# EAGLE schematic 13thISE.ver9 (EAGLE 9.6.2)
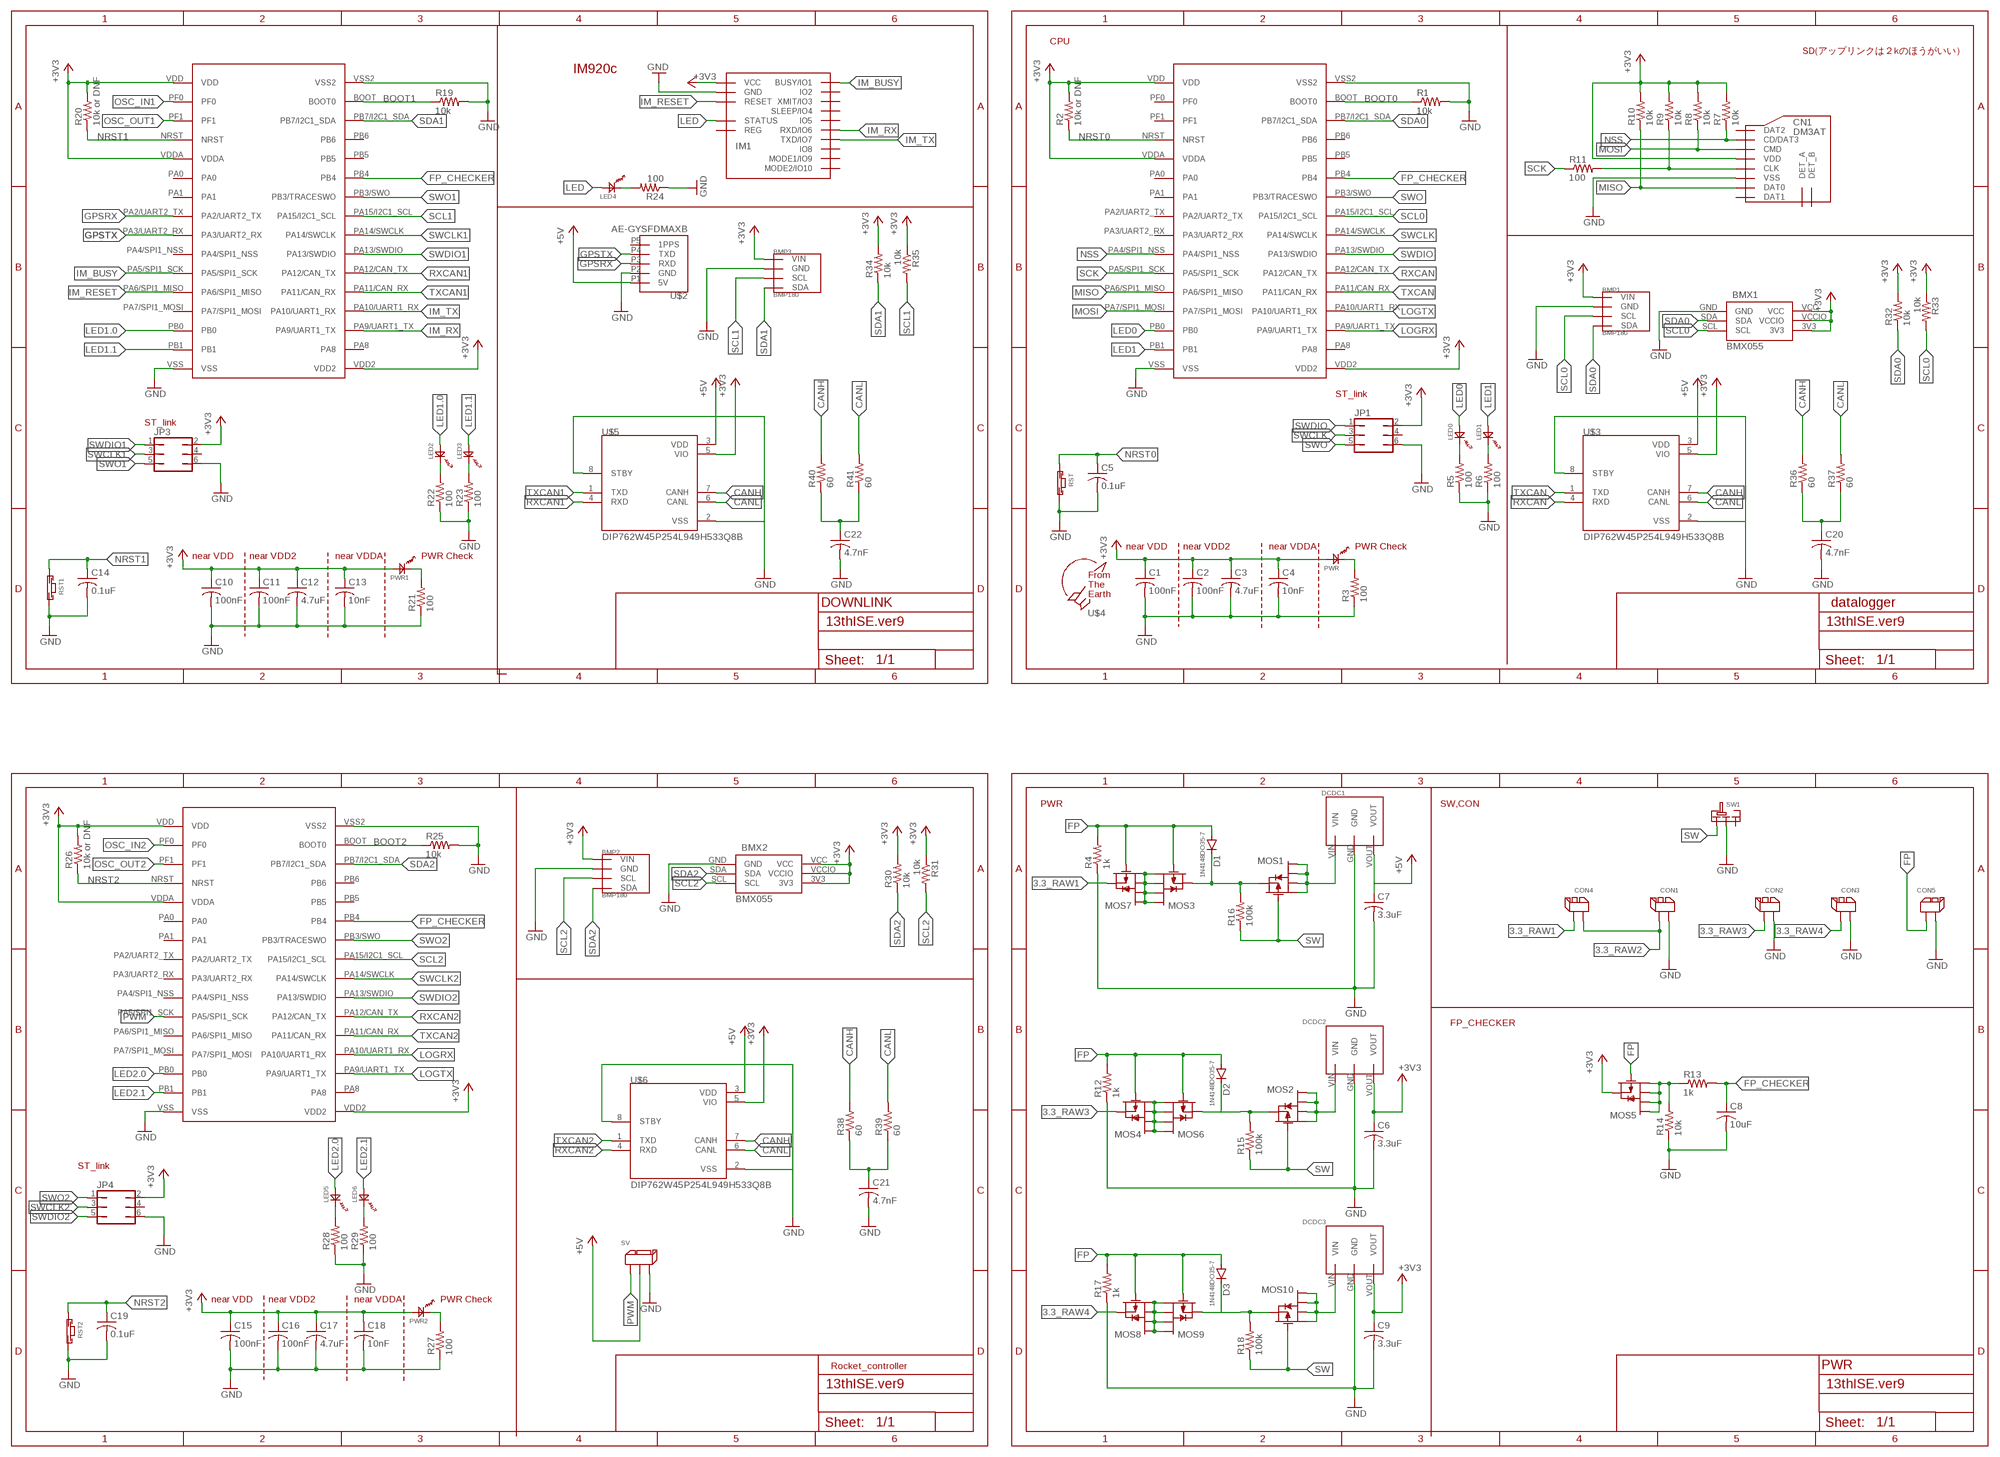
[diagram p0: schematic, sheet 1]

## Parts
BMP1  BMP180  [GY-68]
BMP2  BMP180  [GY-68]
BMP3  BMP180  [GY-68]
BMX1  BMX055  [BMX055]
BMX2  BMX055  [BMX055]
C1  100nF  C-USC1608  [C1608]
C2  100nF  C-USC1608  [C1608]
C3  4.7uF  C-USC1608  [C1608]
C4  10nF  C-USC1608  [C1608]
C5  0.1uF  C-USC1608  [C1608]
C6  3.3uF  C-USC0603  [C0603]
C7  3.3uF  C-USC0603  [C0603]
C8  10uF  C-USC0603  [C0603]
C9  3.3uF  C-USC0603  [C0603]
C10  100nF  C-USC1608  [C1608]
C11  100nF  C-USC1608  [C1608]
C12  4.7uF  C-USC1608  [C1608]
C13  10nF  C-USC1608  [C1608]
C14  0.1uF  C-USC1608  [C1608]
C15  100nF  C-USC1608  [C1608]
C16  100nF  C-USC1608  [C1608]
C17  4.7uF  C-USC1608  [C1608]
C18  10nF  C-USC1608  [C1608]
C19  0.1uF  C-USC1608  [C1608]
C20  4.7nF  C-USC0603  [C0603]
C21  4.7nF  C-USC0603  [C0603]
C22  4.7nF  C-USC0603  [C0603]
CN1  DM3AT  [DM3AT]
CON1  2PIN  [2PIN]
CON2  2PIN  [2PIN]
CON3  2PIN  [2PIN]
CON4  2PIN  [2PIN]
CON5  2PIN  [2PIN]
D1  1N4148DO35-7  [DO35-7]
D2  1N4148DO35-7  [DO35-7]
D3  1N4148DO35-7  [DO35-7]
DCDC1  5V1A_M78AR05-1  [5V1A_M78AR05-1]
DCDC2  3.3V1A_M78AR033-1  [3.3V1A_M78AR033-1]
DCDC3  3.3V1A_M78AR033-1  [3.3V1A_M78AR033-1]
IM1  IM920_IM920C  [IM920_IM920C]
JP1  JP3Q  [JP3Q]
JP3  JP3Q  [JP3Q]
JP4  JP3Q  [JP3Q]
LED0  OSXX1608C1A  [OSXX1608C1A]
LED1  OSXX1608C1A  [OSXX1608C1A]
LED2  OSXX1608C1A  [OSXX1608C1A]
LED3  OSXX1608C1A  [OSXX1608C1A]
LED4  OSXX1608C1A  [OSXX1608C1A]
LED5  OSXX1608C1A  [OSXX1608C1A]
LED6  OSXX1608C1A  [OSXX1608C1A]
MOS1  PCH_SSM6J808R  [SSM6J808R]
MOS2  PCH_SSM6J808R  [SSM6J808R]
MOS3  PCH_SSM6J808R  [SSM6J808R]
MOS4  PCH_SSM6J808R  [SSM6J808R]
MOS5  PCH_SSM6J808R  [SSM6J808R]
MOS6  PCH_SSM6J808R  [SSM6J808R]
MOS7  PCH_SSM6J808R  [SSM6J808R]
MOS8  PCH_SSM6J808R  [SSM6J808R]
MOS9  PCH_SSM6J808R  [SSM6J808R]
MOS10  PCH_SSM6J808R  [SSM6J808R]
PWR  OSXX1608C1A  [OSXX1608C1A]
PWR1  OSXX1608C1A  [OSXX1608C1A]
PWR2  OSXX1608C1A  [OSXX1608C1A]
R1  10k  R-US_R0603  [R0603]
R2  10k or DNF  R-US_R0603  [R0603]
R3  100  R-US_R0603  [R0603]
R4  1k  R-US_R0603  [R0603]
R5  100  R-US_R0603  [R0603]
R6  100  R-US_R0603  [R0603]
R7  10k  R-US_R0603  [R0603]
R8  10k  R-US_R0603  [R0603]
R9  10k  R-US_R0603  [R0603]
R10  10k  R-US_R0603  [R0603]
R11  100  R-US_R0603  [R0603]
R12  1k  R-US_R0603  [R0603]
R13  1k  R-US_R0603  [R0603]
R14  10k  R-US_R0603  [R0603]
R15  100k  R-US_R0603  [R0603]
R16  100k  R-US_R0603  [R0603]
R17  1k  R-US_R0603  [R0603]
R18  100k  R-US_R0603  [R0603]
R19  10k  R-US_R0603  [R0603]
R20  10k or DNF  R-US_R0603  [R0603]
R21  100  R-US_R0603  [R0603]
R22  100  R-US_R0603  [R0603]
R23  100  R-US_R0603  [R0603]
R24  100  R-US_R0603  [R0603]
R25  10k  R-US_R0603  [R0603]
R26  10k or DNF  R-US_R0603  [R0603]
R27  100  R-US_R0603  [R0603]
R28  100  R-US_R0603  [R0603]
R29  100  R-US_R0603  [R0603]
R30  10k  R-US_R0603  [R0603]
R31  10k  R-US_R0603  [R0603]
R32  10k  R-US_R0603  [R0603]
R33  10k  R-US_R0603  [R0603]
R34  10k  R-US_R0603  [R0603]
R35  10k  R-US_R0603  [R0603]
R36  60  R-US_R0603  [R0603]
R37  60  R-US_R0603  [R0603]
R38  60  R-US_R0603  [R0603]
R39  60  R-US_R0603  [R0603]
R40  60  R-US_R0603  [R0603]
R41  60  R-US_R0603  [R0603]
RST  TVAF06-A020B-R  [TVAF06-A020B-R]
RST1  TVAF06-A020B-R  [TVAF06-A020B-R]
RST2  TVAF06-A020B-R  [TVAF06-A020B-R]
STM0  STM32F303K8  [STM32F303K8]
STM1  STM32F303K8  [STM32F303K8]
SV  3PIN  [3PIN]
SW1  SRIDE_SWITCH  [SRIDE_SWITCH]
U$1  STM32F303K8  [STM32F303K8]
U$2  AE-GYSFDMAXB  [AE-GYSFDMAXB]
U$3  DIP762W45P254L949H533Q8B  [DIP762W45P254L949H533Q8B]
U$4  F.T.E.LOGO  [LOGO]
U$5  DIP762W45P254L949H533Q8B  [DIP762W45P254L949H533Q8B]
U$6  DIP762W45P254L949H533Q8B  [DIP762W45P254L949H533Q8B]

## Nets
3.3_RAW1: CON4.P$2 MOS7.4
3.3_RAW2: CON1.P$2 CON4.P$1
3.3_RAW3: CON2.P$2 MOS4.4
3.3_RAW4: CON3.P$2 MOS8.4
+3V3: BMP1.P1(VIN) BMP2.P1(VIN) BMP3.P1(VIN) BMX1.3V3 BMX1.VCC BMX1.VCCIO BMX2.3V3 BMX2.VCC BMX2.VCCIO C1.1 C2.1 C3.1 C4.1 C6.1 C9.1 C10.1 C11.1 C12.1 C13.1 C15.1 C16.1 C17.1 C18.1 CN1.VDD DCDC2.VOUT DCDC3.VOUT IM1.$P17(VCC) JP1.2 JP3.2 JP4.2 MOS5.4 PWR1.AN PWR2.AN PWR.AN R2.2 R7.2 R8.2 R9.2 R10.2 R20.2 R26.2 R30.2 R31.1 R32.2 R33.1 R34.2 R35.1 STM0.VDD STM0.VDD2 STM0.VDDA STM1.VDD STM1.VDD2 STM1.VDDA U$1.VDD U$1.VDD2 U$1.VDDA U$3.5(VIO) U$5.5(VIO) U$6.5(VIO)
+5V: C7.1 DCDC1.VOUT SV.P$2 U$2.P1(5V) U$3.3(VDD) U$5.3(VDD) U$6.3(VDD)
+5V1: DCDC1.VIN MOS1.1 MOS1.2 MOS1.5 MOS1.6
BOOT0: R1.1 STM0.BOOT(BOOT0)
BOOT1: R19.1 STM1.BOOT(BOOT0)
BOOT2: R25.1 U$1.BOOT(BOOT0)
CANH: R36.2 R38.2 R40.2 U$3.7(CANH) U$5.7(CANH) U$6.7(CANH)
CANL: R37.2 R39.2 R41.2 U$3.6(CANL) U$5.6(CANL) U$6.6(CANL)
FP: CON5.P$1 D1.A D2.A D3.A MOS3.3 MOS4.3 MOS5.3 MOS6.3 MOS7.3 MOS8.3 MOS9.3 R4.2 R12.2 R17.2
FP_CHECKER: C8.1 R13.2 STM0.PB4 STM1.PB4 U$1.PB4
GND: BMP1.P2(GND) BMP2.P2(GND) BMP3.P2(GND) BMX1.GND BMX2.GND C1.2 C2.2 C3.2 C4.2 C5.2 C6.2 C7.2 C8.2 C9.2 C10.2 C11.2 C12.2 C13.2 C14.2 C15.2 C16.2 C17.2 C18.2 C19.2 C20.2 C21.2 C22.2 CN1.VSS CON1.P$1 CON2.P$1 CON3.P$1 CON5.P$2 DCDC1.GND DCDC2.GND DCDC3.GND IM1.$P18(GND) JP1.6 JP3.6 JP4.6 R1.2 R3.1 R4.1 R5.1 R6.1 R12.1 R14.1 R17.1 R19.2 R21.1 R22.1 R23.1 R24.1 R25.2 R27.1 R28.1 R29.1 RST1.P$2 RST2.P$2 RST.P$2 STM0.VSS STM0.VSS2 STM1.VSS STM1.VSS2 SV.P$3 SW1.LR U$1.VSS U$1.VSS2 U$2.P2(GND) U$3.2(VSS) U$3.8(STBY) U$5.2(VSS) U$5.8(STBY) U$6.2(VSS) U$6.8(STBY)
GPSRX: STM1.PA2/UART2_TX U$2.P3(RXD)
GPSTX: STM1.PA3/UART2_RX U$2.P4(TXD)
IM_BUSY [im]: IM1.$P1(BUSY/IO1) STM1.PA5/SPI1_SCK
IM_RESET [im]: IM1.$P19(RESET) STM1.PA6/SPI1_MISO
IM_RX [im]: IM1.$P6(RXD/IO6) STM1.PA9/UART1_TX
IM_TX [im]: IM1.$P7(TXD/IO7) STM1.PA10/UART1_RX
LED [im]: IM1.$P15(STATUS) LED4.AN
LED0: LED0.AN STM0.PB0
LED1: LED1.AN STM0.PB1
LED1.0: LED2.AN STM1.PB0
LED1.1: LED3.AN STM1.PB1
LED2.0: LED5.AN U$1.PB0
LED2.1: LED6.AN U$1.PB1
LOGRX: STM0.PA9/UART1_TX U$1.PA10/UART1_RX
LOGTX: STM0.PA10/UART1_RX U$1.PA9/UART1_TX
MISO: CN1.DAT0 R10.1 STM0.PA6/SPI1_MISO
MOSI: CN1.CMD R8.1 STM0.PA7/SPI1_MOSI
N$1: PWR.CT R3.2
N$2: LED0.CT R5.2
N$3: D1.C MOS1.4 MOS3.4 R16.2
N$4: LED1.CT R6.2
N$5: D2.C MOS2.4 MOS6.4 R15.2
N$6: MOS4.1 MOS4.2 MOS4.5 MOS4.6 MOS6.1 MOS6.2 MOS6.5 MOS6.6
N$7: CN1.CLK R9.1 R11.2
N$8: DCDC2.VIN MOS2.1 MOS2.2 MOS2.5 MOS2.6
N$9: D3.C MOS9.4 MOS10.4 R18.2
N$10: MOS8.1 MOS8.2 MOS8.5 MOS8.6 MOS9.1 MOS9.2 MOS9.5 MOS9.6
N$11: PWR2.CT R27.2
N$12: MOS3.1 MOS3.2 MOS3.5 MOS3.6 MOS7.1 MOS7.2 MOS7.5 MOS7.6
N$13: DCDC3.VIN MOS10.1 MOS10.2 MOS10.5 MOS10.6
N$14: MOS5.1 MOS5.2 MOS5.5 MOS5.6 R13.1 R14.2
N$15: PWR1.CT R21.2
N$16: LED2.CT R22.2
N$17: LED3.CT R23.2
N$18: LED4.CT R24.2
N$19: LED5.CT R28.2
N$20: LED6.CT R29.2
N$21: C21.1 R38.1 R39.1
N$22: C22.1 R40.1 R41.1
N$25: C20.1 R36.1 R37.1
NRST0: C5.1 R2.1 RST.P$1 STM0.NRST
NRST1: C14.1 R20.1 RST1.P$1 STM1.NRST
NRST2: C19.1 R26.1 RST2.P$1 U$1.NRST
NSS: CN1.CD/DAT3 R7.1 STM0.PA4/SPI1_NSS
OSC_IN1: STM1.PF0
OSC_IN2: U$1.PF0
OSC_OUT1: STM1.PF1
OSC_OUT2: U$1.PF1
PWM: SV.P$1 U$1.PA5/SPI1_SCK
RXCAN: STM0.PA12/CAN_TX U$3.4(RXD)
RXCAN1: STM1.PA12/CAN_TX U$5.4(RXD)
RXCAN2: U$1.PA12/CAN_TX U$6.4(RXD)
SCK: R11.1 STM0.PA5/SPI1_SCK
SCL0: BMP1.P3(SCL) BMX1.SCL R33.2 STM0.PA15/I2C1_SCL
SCL1: BMP3.P3(SCL) R35.2 STM1.PA15/I2C1_SCL
SCL2: BMP2.P3(SCL) BMX2.SCL R31.2 U$1.PA15/I2C1_SCL
SDA0: BMP1.P4(SDA) BMX1.SDA R32.1 STM0.PB7/I2C1_SDA
SDA1: BMP3.P4(SDA) R34.1 STM1.PB7/I2C1_SDA
SDA2: BMP2.P4(SDA) BMX2.SDA R30.1 U$1.PB7/I2C1_SDA
SW: MOS1.3 MOS2.3 MOS10.3 R15.1 R16.1 R18.1 SW1.L
SWCLK: JP1.3 STM0.PA14/SWCLK
SWCLK1: JP3.3 STM1.PA14/SWCLK
SWCLK2: JP4.3 U$1.PA14/SWCLK
SWDIO: JP1.1 STM0.PA13/SWDIO
SWDIO1: JP3.1 STM1.PA13/SWDIO
SWDIO2: JP4.5 U$1.PA13/SWDIO
SWO: JP1.5 STM0.PB3/SWO(PB3/TRACESWO)
SWO1: JP3.5 STM1.PB3/SWO(PB3/TRACESWO)
SWO2: JP4.1 U$1.PB3/SWO(PB3/TRACESWO)
TXCAN: STM0.PA11/CAN_RX U$3.1(TXD)
TXCAN1: STM1.PA11/CAN_RX U$5.1(TXD)
TXCAN2: U$1.PA11/CAN_RX U$6.1(TXD)
Unconnected: CN1.DAT1 CN1.DAT2 CN1.DET_A CN1.DET_B IM1.$P2(IO2) IM1.$P3(XMIT/IO3) IM1.$P4(SLEEP/IO4) IM1.$P5(IO5) IM1.$P8(IO8) IM1.$P9(MODE1/IO9) IM1.$P10(MODE2/IO10) IM1.$P16(REG) JP1.4 JP3.4 JP4.4 STM0.PA0 STM0.PA1 STM0.PA2/UART2_TX STM0.PA3/UART2_RX STM0.PA8 STM0.PB5 STM0.PB6 STM0.PF0 STM0.PF1 STM1.PA0 STM1.PA1 STM1.PA4/SPI1_NSS STM1.PA7/SPI1_MOSI STM1.PA8 STM1.PB5 STM1.PB6 SW1.R U$1.PA0 U$1.PA1 U$1.PA2/UART2_TX U$1.PA3/UART2_RX U$1.PA4/SPI1_NSS U$1.PA6/SPI1_MISO U$1.PA7/SPI1_MOSI U$1.PA8 U$1.PB5 U$1.PB6 U$2.P5(1PPS)

## Notes on the sheet
- CPU
- SD(アップリンクは２kのほうがいい）
- IM920c
- ST_link
- ST_link
- near VDD | near VDD2 | near VDDA | PWR Check
- near VDD | near VDD2 | near VDDA | PWR Check
- DOWNLINK | datalogger
- PWR | SW,CON
- FP_CHECKER
- ST_link
- near VDD | near VDD2 | near VDDA | PWR Check
- Rocket_controller | PWR

## Library data of the parts
BMP1-BMP3 = BMP180:BMP180
BMX1 BMX2 = BMX055:BMX055
C1-C22 = rcl:C-US: CAPACITOR, American symbol; SPICEPREFIX: C
CN1 = microSD:DM3AT
CON1-CON5 = XR Connector:2PIN
D1-D3 = diode:1N4148: DIODE high speed (Philips)
DCDC1 = DC-DC:5V1A_M78AR05-1
DCDC2 DCDC3 = DC-DC:3.3V1A_M78AR033-1
IM1 = CANSAT12th:IM920_IM920C
JP1 JP3 JP4 = jumper:JP3Q: JUMPER
LED0 LED1-LED6 PWR PWR1 PWR2 = Chip LED:OSXX1608C1A
MOS1-MOS10 = Chip MOSFET:PCH_SSM6J808R
R1-R41 = rcl:R-US_: RESISTOR, American symbol; SPICEPREFIX: R
RST RST1 RST2 = Tact switch:TVAF06-A020B-R
STM0 STM1 U$1 = STM32F303K8:STM32F303K8
SV = XR Connector:3PIN
SW1 = Sride Switch:SRIDE_SWITCH
U$2 = AE-GYSFDMAXB:AE-GYSFDMAXB
U$3 U$5 U$6 = MCP2562-E_P:DIP762W45P254L949H533Q8B
U$4 = logo:F.T.E.LOGO

## Net classes
0 default: width 0.406 mm